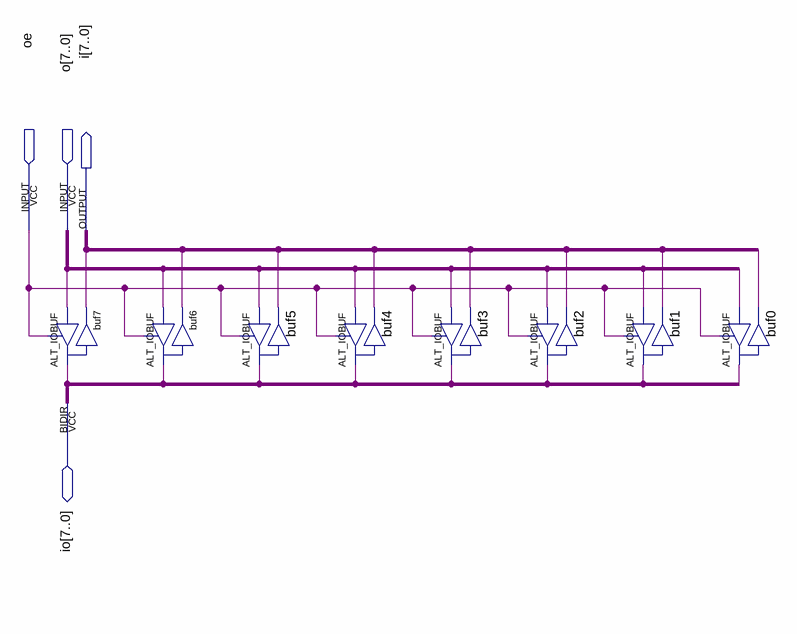
[diagram p0: schematic sheet]
// Quartus schematic 8BIT_IOBUF.bdf as structural Verilog: 8 symbols, 4 pins
module \8BIT_IOBUF  (
  input  oe,
  input  [7:0] o,
  inout  [7:0] io,
  output [7:0] i
);

  ALT_IOBUF buf7 (.i(o[7]), .oe(oe), .o(i[7]), .io(io[7]));
  ALT_IOBUF buf6 (.i(o[6]), .oe(oe), .o(i[6]), .io(io[6]));
  ALT_IOBUF buf5 (.i(o[5]), .oe(oe), .o(i[5]), .io(io[5]));
  ALT_IOBUF buf4 (.i(o[4]), .oe(oe), .o(i[4]), .io(io[4]));
  ALT_IOBUF buf3 (.i(o[3]), .oe(oe), .o(i[3]), .io(io[3]));
  ALT_IOBUF buf2 (.i(o[2]), .oe(oe), .o(i[2]), .io(io[2]));
  ALT_IOBUF buf1 (.i(o[1]), .oe(oe), .o(i[1]), .io(io[1]));
  ALT_IOBUF buf0 (.i(o[0]), .oe(oe), .o(i[0]), .io(io[0]));
endmodule
